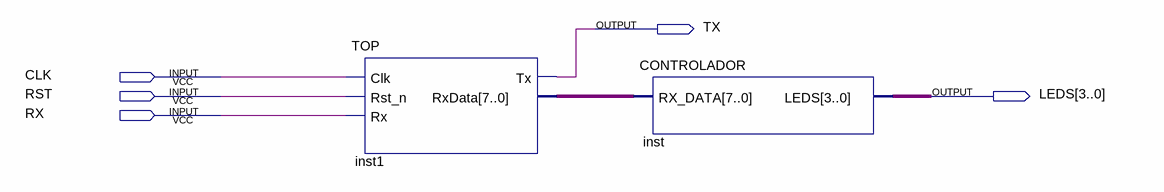
[diagram p0: schematic sheet]
// Quartus schematic LED_BT.bdf as structural Verilog: 2 symbols, 5 pins
module LED_BT (
  input  CLK,
  input  RST,
  input  RX,
  output TX,
  output [3:0] LEDS
);

  wire [7:0] inst1_rxdata;

  TOP inst1 (.Clk(CLK), .Rst_n(RST), .Rx(RX), .Tx(TX), .RxData(inst1_rxdata));
  CONTROLADOR inst (.RX_DATA(inst1_rxdata), .LEDS(LEDS));
endmodule
